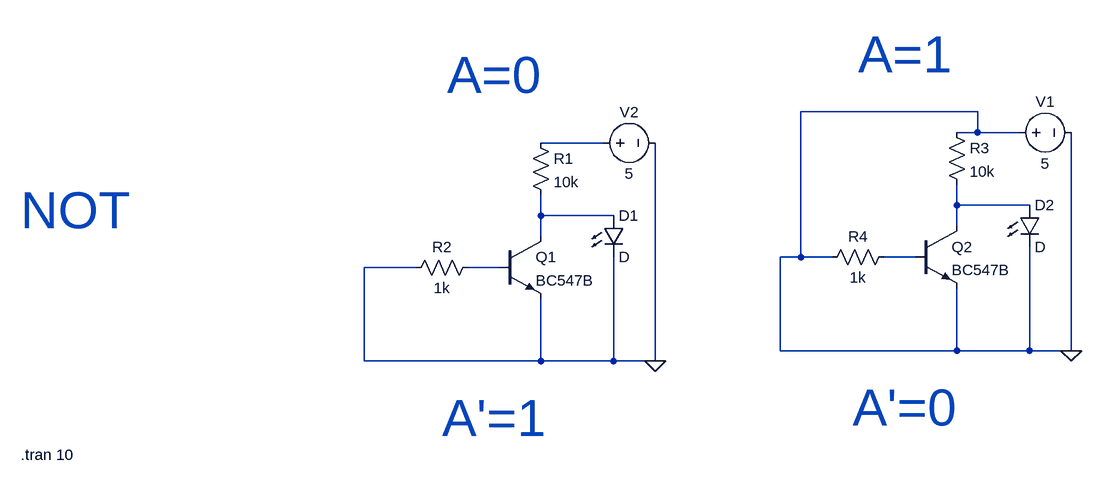
[diagram p0: schematic NotGate.asc]
NotGate.asc, the LTspice schematic file:
Version 4.1
SHEET 1 1332 680
WIRE 1168 -144 896 -144
WIRE 1168 -112 1168 -144
WIRE 1168 -112 1136 -112
WIRE 1232 -112 1168 -112
WIRE 592 -96 496 -96
WIRE 1136 0 1136 -32
WIRE 1248 0 1136 0
WIRE 496 16 496 -16
WIRE 608 16 496 16
WIRE 1136 32 1136 0
WIRE 496 48 496 16
WIRE 896 80 896 -144
WIRE 896 80 864 80
WIRE 944 80 896 80
WIRE 1072 80 1024 80
WIRE 304 96 224 96
WIRE 432 96 384 96
WIRE 864 224 864 80
WIRE 1136 224 1136 128
WIRE 1136 224 864 224
WIRE 1248 224 1248 64
WIRE 1248 224 1136 224
WIRE 1312 224 1312 -112
WIRE 1312 224 1248 224
WIRE 224 240 224 96
WIRE 496 240 496 144
WIRE 496 240 224 240
WIRE 608 240 608 80
WIRE 608 240 496 240
WIRE 672 240 672 -96
WIRE 672 240 608 240
FLAG 672 240 0
FLAG 1312 224 0
SYMBOL LED 592 16 R0
SYMATTR InstName D1
SYMBOL npn 432 48 R0
SYMATTR InstName Q1
SYMATTR Value BC547B
SYMBOL res 480 -112 R0
SYMATTR InstName R1
SYMATTR Value 10k
SYMBOL res 400 80 R90
WINDOW 0 0 56 VBottom 2
WINDOW 3 32 56 VTop 2
SYMATTR InstName R2
SYMATTR Value 1k
SYMBOL voltage 576 -96 M90
WINDOW 0 -32 56 VBottom 2
WINDOW 3 32 56 VTop 2
WINDOW 123 0 0 Left 0
WINDOW 39 0 0 Left 0
SYMATTR InstName V2
SYMATTR Value 5
SYMBOL LED 1232 0 R0
SYMATTR InstName D2
SYMBOL npn 1072 32 R0
SYMATTR InstName Q2
SYMATTR Value BC547B
SYMBOL res 1120 -128 R0
SYMATTR InstName R3
SYMATTR Value 10k
SYMBOL res 1040 64 R90
WINDOW 0 0 56 VBottom 2
WINDOW 3 32 56 VTop 2
SYMATTR InstName R4
SYMATTR Value 1k
SYMBOL voltage 1216 -112 M90
WINDOW 0 -32 56 VBottom 2
WINDOW 3 32 56 VTop 2
WINDOW 123 0 0 Left 0
WINDOW 39 0 0 Left 0
SYMATTR InstName V1
SYMATTR Value 5
TEXT 352 -200 Left 6 ;A=0
TEXT -304 8 Left 6 ;NOT
TEXT 344 328 Left 6 ;A'=1
TEXT 984 -232 Left 6 ;A=1
TEXT 976 312 Left 6 ;A'=0
TEXT -304 384 Left 2 !.tran 10

The netlist it stands for:
* NotGate.asc
D1 N003 0 D
Q1 N003 N005 0 0 BC547B
R1 N001 N003 10k
R2 N005 0 1k
V2 N001 0 5
D2 N002 0 D
Q2 N002 N004 0 0 BC547B
R3 0 N002 10k
R4 N004 0 1k
V1 0 0 5
.model D D
.lib standard.dio
.model NPN NPN
.model PNP PNP
.lib standard.bjt
* A=0
* NOT
* A'=1
* A=1
* A'=0
.tran 10
.backanno
.end